# Altium schematic sheet BACKUP_POWER_2.SchDoc
size A4
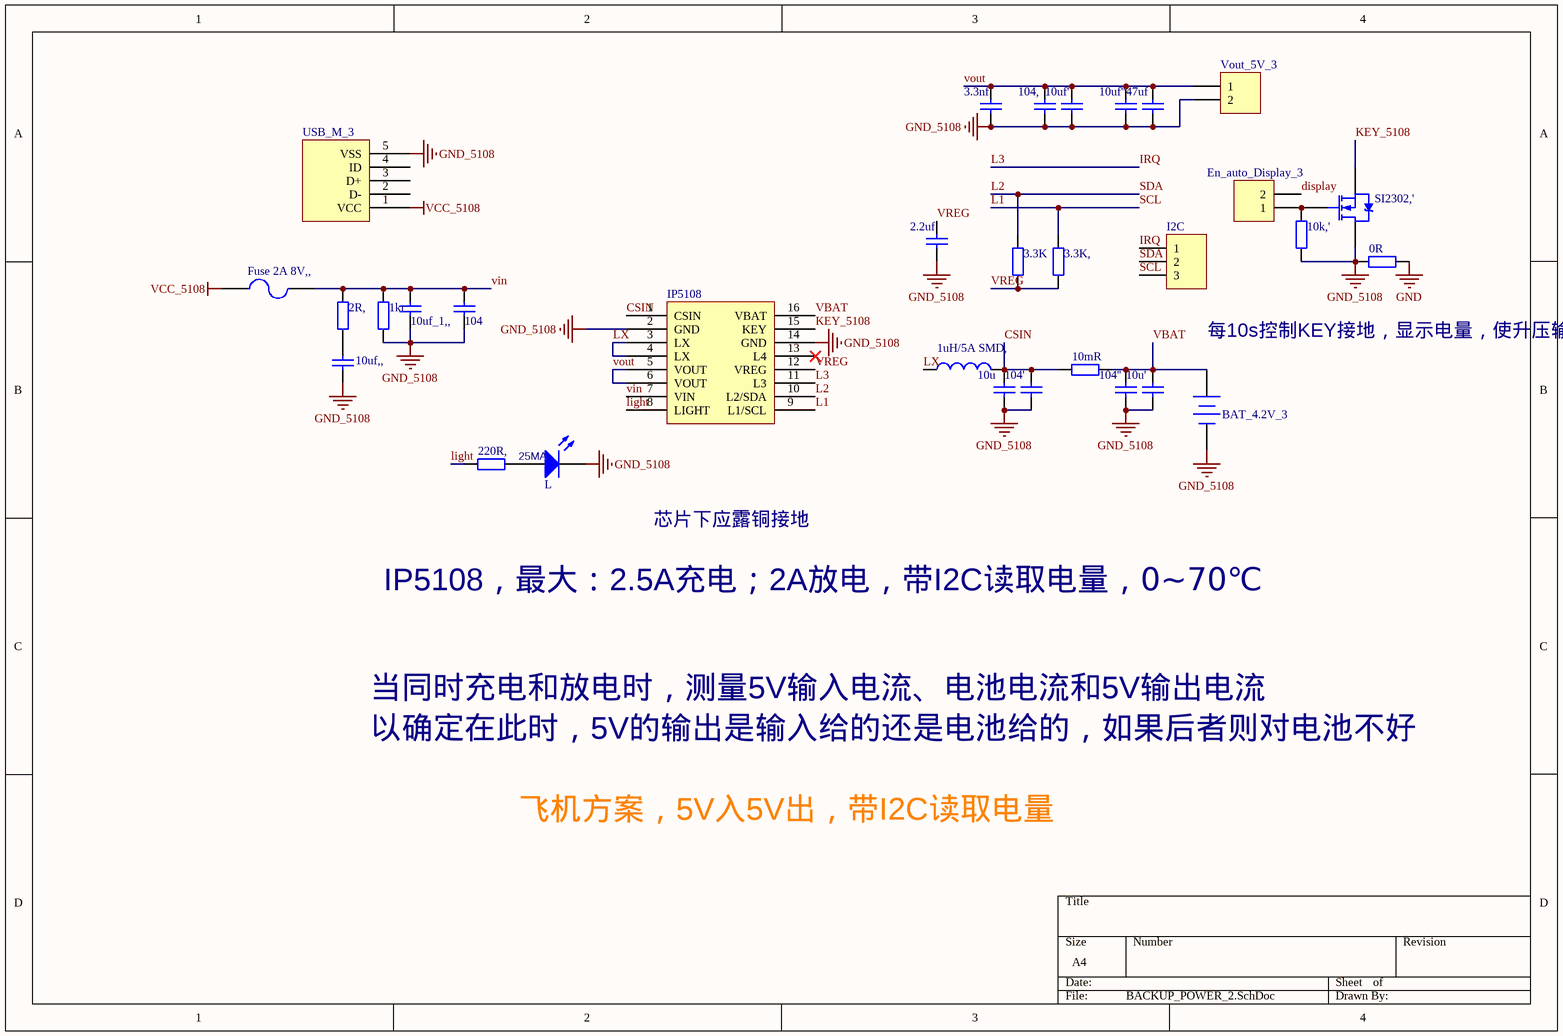
[diagram p0: BACKUP_POWER_2.SchDoc]

## Parts
0R  Res2  [0805A]  (value not drawn)
1kr  Res2  [0805A]  (value not drawn)
1uH/5A_SMD,  Inductor  [6 X 6-L]  (value not drawn)
2.2uf  Cap  [C-RAD-0805]  (value not drawn)
2R,  Res2  [0805A]  (value not drawn)
3.3K  Res2  [0805A]  (value not drawn)
3.3K,  Res2  [0805A]  (value not drawn)
3.3nf  Cap  [C-RAD-0805]  (value not drawn)
10k,'  Res2  [0805A]  (value not drawn)
10mR  Res2  [1206R]  (value not drawn)
10u  Cap  [C-RAD-0805]  (value not drawn)
10u'  Cap  [C-RAD-0805]  (value not drawn)
10uf'  Cap  [C-RAD-0805]  (value not drawn)
10uf''  Cap  [C-RAD-0805]  (value not drawn)
10uf,,  Cap  [C-RAD-0805]  (value not drawn)
10uf_1,,  Cap  [C-RAD-0805]  (value not drawn)
47uf  Cap  [C-RAD-0805]  (value not drawn)
104  Cap  [C-RAD-0805]  (value not drawn)
104'  Cap  [C-RAD-0805]  (value not drawn)
104''  Cap  [C-RAD-0805]  (value not drawn)
104,  Cap  [C-RAD-0805]  (value not drawn)
220R,  Res2  [0805A]  (value not drawn)
BAT_4.2V_3  B  [HDR1X2]  (value not drawn)
En_auto_Display_3  Header 2  [HDR1X2]  (value not drawn)
Fuse_2A_8V,,  Fuse 2  [1812F]  (value not drawn)
I2C  Header 3  [HDR1X3]  (value not drawn)
IP5108  (no value)  [SOP16]
L  LED0  [LED_0805]  (value not drawn)
SI2302,'  LR7843  [SOT-23]  (value not drawn)
USB_M_3  USB_M  [USB_MICRO]  (value not drawn)
Vout_5V_3  Header 2  [HDR1X2]  (value not drawn)

## Nets
GND: 0R.1
GND_5108: 0R.2 1kr.1 2.2uf.1 3.3nf.1 10k,'.2 10u.2 10u'.2 10uf'.2 10uf''.2 10uf,,.2 10uf_1,,.2 47uf.2 104.2 104'.2 104''.2 104,.2 BAT_4.2V_3.2(-) IP5108.2(GND) IP5108.14(GND) L.2(K) SI2302,'.2(D) USB_M_3.5(VSS) Vout_5V_3.2
VCC_5108: Fuse_2A_8V,,.1 USB_M_3.1(VCC)
CSIN: 1uH/5A_SMD,.2 10mR.1 10u.1 104'.1 IP5108.1(CSIN)
display: En_auto_Display_3.2
IRQ: I2C.1 IP5108.11(L3)  [also labelled L3]
KEY_5108: IP5108.15(KEY) SI2302,'.3(S)
L1: 3.3K,.2 I2C.3 IP5108.9(L1/SCL)  [also labelled SCL]
L2: 3.3K.2 I2C.2 IP5108.10(L2/SDA)  [also labelled SDA]
light: 220R,.2 IP5108.8(LIGHT)
LX: 1uH/5A_SMD,.1 IP5108.3(LX) IP5108.4(LX)
VBAT: 10mR.2 10u'.1 104''.1 BAT_4.2V_3.1(+) IP5108.16(VBAT)
vin: 1kr.2 2R,.2 10uf_1,,.1 104.1 Fuse_2A_8V,,.2 IP5108.7(VIN)
vout: 3.3nf.2 10uf'.1 10uf''.1 47uf.1 104,.1 IP5108.5(VOUT) IP5108.6(VOUT) Vout_5V_3.1
VREG: 2.2uf.2 3.3K.1 3.3K,.1 IP5108.12(VREG)
Net2R,_1: 2R,.1 10uf,,.1
Net10k,'_1: 10k,'.1 En_auto_Display_3.1 SI2302,'.1(G)
Net220R,_1: 220R,.1 L.1(A)

Not connected (* = marked no-connect by the designer): IP5108 13(L4)*; USB_M_3 2(D-) 3(D+) 4(ID)

## Notes on the sheet
- 每10s控制KEY接地，显示电量，使升压输出
- (near L) 25MA
- 芯片下应露铜接地
- IP5108，最大：2.5A充电；2A放电，带I2C读取电量，0~70℃
- 当同时充电和放电时，测量5V输入电流、电池电流和5V输出电流
- 以确定在此时，5V的输出是输入给的还是电池给的，如果后者则对电池不好
- 飞机方案，5V入5V出，带I2C读取电量

## Library data of the parts
0R 1kr 2R, 3.3K 3.3K, 10k,' 10mR 220R, = Res2: Resistor; Value: 1K; Published: 8-Jun-2000; LatestRevisionDate: 17-Jul-2002; LatestRevisionNote: Re-released for DXP Platform.; PackageReference: AXIAL-0.4; Publisher: Altium Limited; PackageDescription: Axial Device, Thru-Hole; 2 Leads; 0.4 in Pin Spacing
1uH/5A_SMD, = Inductor: Code_IEC: 1005; Published: 8-Jun-2000; LatestRevisionDate: 29-May-2009; LatestRevisionNote: IPC-7351 Footprint Added.; PackageReference: 0402-A; Publisher: Altium Limited; PackageDescription: Chip Inductor; Code_JEITA: 0402
2.2uf 3.3nf 10u 10u' 10uf' 10uf'' 10uf,, 10uf_1,, 47uf 104 104' 104'' 104, = Cap: Capacitor; Value: 0.1uF; Published: 8-Jun-2000; LatestRevisionDate: 17-Jul-2002; LatestRevisionNote: Re-released for DXP Platform.; PackageReference: RAD-0.3; Publisher: Altium Limited; PackageDescription: Radial Cap, Thru-Hole; 2 Leads; 0.3 in Pin Spacing
BAT_4.2V_3 = BAT
En_auto_Display_3 Vout_5V_3 = Header 2: Header, 2-Pin; LatestRevisionDate: 17-Jul-2002; LatestRevisionNote: Re-released for DXP Platform.; Publisher: Altium Limited
Fuse_2A_8V,, = Fuse 2: Fuse; Published: 8-Jun-2000; LatestRevisionDate: 17-Jul-2002; LatestRevisionNote: Re-released for DXP Platform.; PackageReference: PIN-W2/E2.8; Publisher: Altium Limited; PackageDescription: Thru-Hole; 2 Leads
I2C = Header 3: Header, 3-Pin; LatestRevisionDate: 17-Jul-2002; LatestRevisionNote: Re-released for DXP Platform.; Publisher: Altium Limited
IP5108 = IP5108
L = LED0: 发光二极管; Published: 8-Jun-2000; LatestRevisionDate: 08-Jul-2005; LatestRevisionNote: Mech Layer 1 removed.; PackageReference: LED-0; Publisher: Altium Limited
SI2302,' = NMOS-2: N-Channel Power MOSFET; Note: Pin 2 is electrically connected to pin 4.; Published: 8-Jun-2000; LatestRevisionDate: 17-Jul-2002; LatestRevisionNote: Re-released for DXP Platform.; DatasheetDocument: PD-9.814; PackageReference: TO-220AB; Publisher: Altium Limited; Code_JEDEC: TO-220-AB; ComponentLink1Description: Manufacturer Link; ComponentLink1URL: http://www.irf.com/
USB_M_3 = USB_M: MicroUSB接口